# Altium schematic sheet Sheet_Clock.SchDoc
size A4
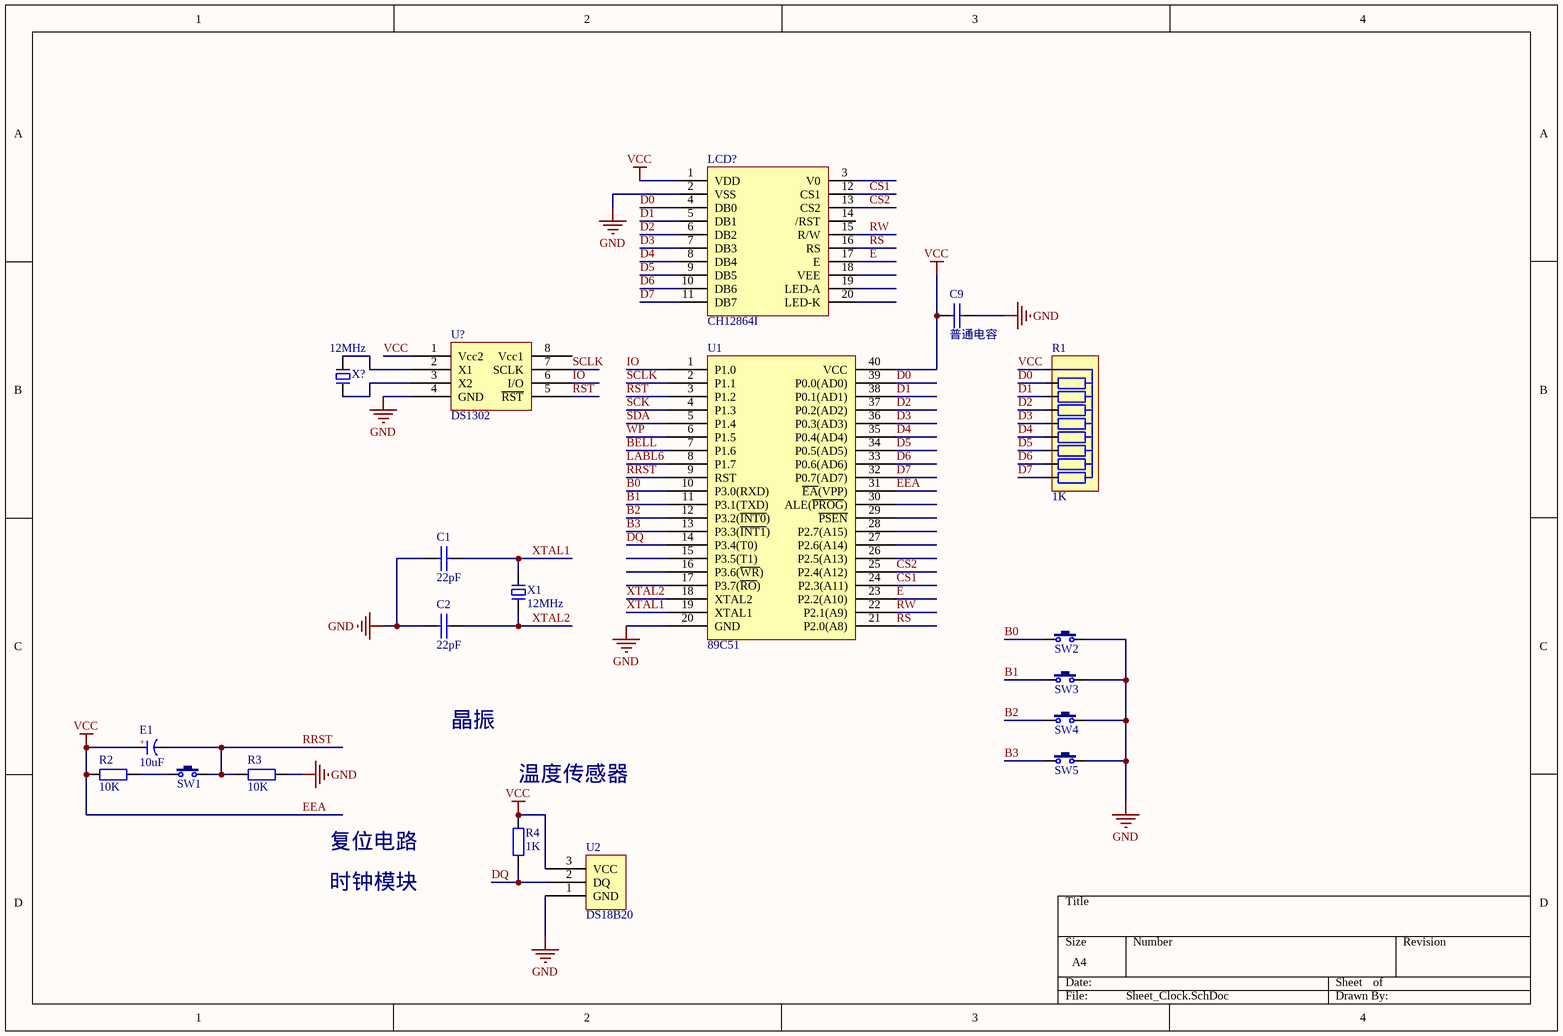
[diagram p0: Sheet_Clock.SchDoc]

## Parts
C1  22pF  [RAD0.1]
C2  22pF  [RAD0.1]
C9  普通电容  [RAD0.1]
E1  10uF  [CAP 1.5*4*8]
LCD?  CH12864I  [LCD-12864A]
R1  1K  [R SIP9-2.54]
R2  10K  [R 0805_L]
R3  10K  [R 0805_L]
R4  1K  [R 0805_L]
SW1  3x6x5  [TSW SMD-3*6*2.5]  (value not drawn)
SW2  3x6x5  [TSW SMD-3*6*2.5]  (value not drawn)
SW3  3x6x5  [TSW SMD-3*6*2.5]  (value not drawn)
SW4  3x6x5  [TSW SMD-3*6*2.5]  (value not drawn)
SW5  3x6x5  [TSW SMD-3*6*2.5]  (value not drawn)
U1  89C51
U2  DS18B20
U?  DS1302
X1  12MHz  [OSC HC-49S]
X?  12MHz  [OSC HC-49S]

## Nets
EEA: C9.2 E1.1(A) LCD?.1(VDD) R1.1 R2.1 R4.2 U1.31(~{EA}(VPP)) U1.40(VCC) U2.3(VCC) U?.1(Vcc2)  [also labelled VCC]
GND: C1.1 C2.1 C9.1 LCD?.2(VSS) R3.1 SW2.2 SW3.2 SW4.2 SW5.2 U1.20(GND) U2.1(GND) U?.4(GND)
B0: SW2.1 U1.10(P3.0(RXD))
B1: SW3.1 U1.11(P3.1(TXD))
B2: SW4.1 U1.12(P3.2(~{INT0}))
B3: SW5.1 U1.13(P3.3(~{INT1}))
BELL: U1.7(P1.6)
CS1: LCD?.12(CS1) U1.24(P2.3(A11))
CS2: LCD?.13(CS2) U1.25(P2.4(A12))
D0: LCD?.4(DB0) R1.2 U1.39(P0.0(AD0))
D1: LCD?.5(DB1) R1.3 U1.38(P0.1(AD1))
D2: LCD?.6(DB2) R1.4 U1.37(P0.2(AD2))
D3: LCD?.7(DB3) R1.5 U1.36(P0.3(AD3))
D4: LCD?.8(DB4) R1.6 U1.35(P0.4(AD4))
D5: LCD?.9(DB5) R1.7 U1.34(P0.5(AD5))
D6: LCD?.10(DB6) R1.8 U1.33(P0.6(AD6))
D7: LCD?.11(DB7) R1.9 U1.32(P0.7(AD7))
DQ: R4.1 U1.14(P3.4(T0)) U2.2(DQ)
E: LCD?.17(E) U1.23(P2.2(A10))
IO: U1.1(P1.0) U?.6(I/O)
LABL6: U1.8(P1.7)
RRST: E1.2(K) R3.2 SW1.2 U1.9(RST)
RS: LCD?.16(RS) U1.21(P2.0(A8))
RST: U1.3(P1.2) U?.5(~{RST})
RW: LCD?.15(R/W) U1.22(P2.1(A9))
SCK: U1.4(P1.3)
SCLK: U1.2(P1.1) U?.7(SCLK)
SDA: U1.5(P1.4)
WP: U1.6(P1.5)
XTAL1: C1.2 U1.19(XTAL1) X1.2
XTAL2: C2.2 U1.18(XTAL2) X1.1
NetR2_2: R2.2 SW1.1
NetU?_2: U?.2(X1) X?.2
NetU?_3: U?.3(X2) X?.1

Not connected (* = marked no-connect by the designer): LCD? 3(V0) 14(/RST) 18(VEE) 19(LED-A) 20(LED-K); U1 15(P3.5(T1)) 16(P3.6(~{WR})) 17(P3.7(~{RO})) 26(P2.5(A13)) 27(P2.6(A14)) 28(P2.7(A15)) 29(~{PSEN}) 30(ALE(~{PROG})); U? 8(Vcc1)

## Notes on the sheet
- 晶振
- (near R4) 温度传感器
- 复位电路
- 时钟模块
- (in symbol C-CAP) +

## Library data of the parts
C1 C2 C9 = 普通电容: Capacitor
E1 = C-CAP: 直插电解电容; 版权归属: 源创客; BOM名称: 直插电解电容; 学习资源: www.ooocke.com
LCD? = CH12864I: 12864 点阵屏; 版权归属: 源创客; BOM名称: 12864 点阵屏; 学习资源: www.ooocke.com
R1 = R SIP9: 单列直插排阻; 版权归属: 源创客; BOM名称: 单列直插排阻; 学习资源: www.ooocke.com
R2-R4 = R: 贴片电阻; 版权归属: 源创客; BOM名称: 贴片电阻; 学习资源: www.ooocke.com
SW1-SW5 = TSW 3x6: 3x6轻触开关; 版权归属: 源创客; BOM名称: 3x6轻触开关; 学习资源: www.ooocke.com
U1 = 89C51: 89C51单片机
U2 = DS18B20: 温度传感器
U? = DS1302: 时钟芯片
X1 X? = XTAL-2P: 2脚无源脚晶振; 版权归属: 源创客; BOM名称: 2脚无源脚晶振; 学习资源: www.ooocke.com